# EAGLE design CAP-MODULE (EAGLE 9.6.2)
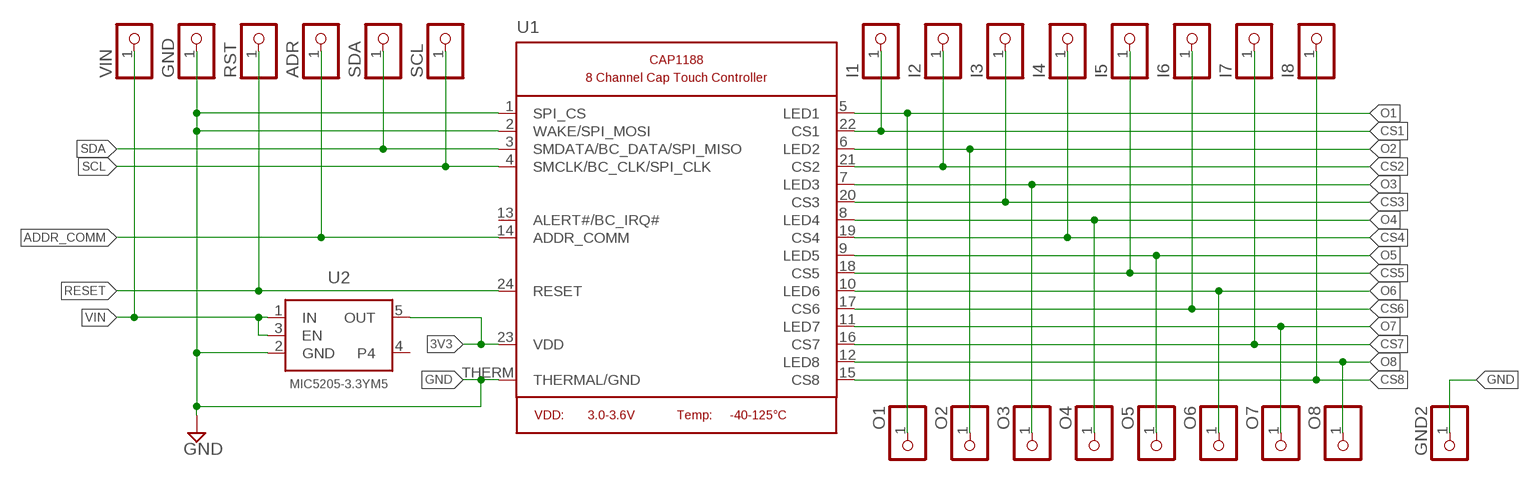
[diagram p0: schematic, sheet 1]

## Parts
ADR  PINHD-1X1CB  [1X01-CLEANBIG]
GND  PINHD-1X1CB  [1X01-CLEANBIG]
GND2  PINHD-1X1CB  [1X01-CLEANBIG]
I1  PINHD-1X1CB  [1X01-CLEANBIG]
I2  PINHD-1X1CB  [1X01-CLEANBIG]
I3  PINHD-1X1CB  [1X01-CLEANBIG]
I4  PINHD-1X1CB  [1X01-CLEANBIG]
I5  PINHD-1X1CB  [1X01-CLEANBIG]
I6  PINHD-1X1CB  [1X01-CLEANBIG]
I7  PINHD-1X1CB  [1X01-CLEANBIG]
I8  PINHD-1X1CB  [1X01-CLEANBIG]
O1  PINHD-1X1CB  [1X01-CLEANBIG]
O2  PINHD-1X1CB  [1X01-CLEANBIG]
O3  PINHD-1X1CB  [1X01-CLEANBIG]
O4  PINHD-1X1CB  [1X01-CLEANBIG]
O5  PINHD-1X1CB  [1X01-CLEANBIG]
O6  PINHD-1X1CB  [1X01-CLEANBIG]
O7  PINHD-1X1CB  [1X01-CLEANBIG]
O8  PINHD-1X1CB  [1X01-CLEANBIG]
RST  PINHD-1X1CB  [1X01-CLEANBIG]
SCL  PINHD-1X1CB  [1X01-CLEANBIG]
SDA  PINHD-1X1CB  [1X01-CLEANBIG]
U1  MICROBUILDER_CAP1188  [MICROBUILDER_QFN24_4MM_SMSC]
U2  MIC5205-3.3YM5  MICROBUILDER_VREG_SOT23-5  [MICROBUILDER_SOT23-5]
VIN  PINHD-1X1CB  [1X01-CLEANBIG]

## Nets
3V3 [8 mil]: U1.23(VDD) U2.5(OUT)
ADDR_COMM [8 mil]: ADR.1 U1.14(ADDR_COMM)
CS1 [8 mil]: I1.1 U1.22(CS1)
CS2 [8 mil]: I2.1 U1.21(CS2)
CS3 [8 mil]: I3.1 U1.20(CS3)
CS4 [8 mil]: I4.1 U1.19(CS4)
CS5 [8 mil]: I5.1 U1.18(CS5)
CS6 [8 mil]: I6.1 U1.17(CS6)
CS7 [8 mil]: I7.1 U1.16(CS7)
CS8 [8 mil]: I8.1 U1.15(CS8)
GND [8 mil]: GND2.1 GND.1 U1.1(SPI_CS) U1.2(WAKE/SPI_MOSI) U1.THERM(THERMAL/GND) U2.2(GND)
O1 [8 mil]: O1.1 U1.5(LED1)
O2 [8 mil]: O2.1 U1.6(LED2)
O3 [8 mil]: O3.1 U1.7(LED3)
O4 [8 mil]: O4.1 U1.8(LED4)
O5 [8 mil]: O5.1 U1.9(LED5)
O6 [8 mil]: O6.1 U1.10(LED6)
O7 [8 mil]: O7.1 U1.11(LED7)
O8 [8 mil]: O8.1 U1.12(LED8)
RESET [8 mil]: RST.1 U1.24(RESET)
SCL [8 mil]: SCL.1 U1.4(SMCLK/BC_CLK/SPI_CLK)
SDA [8 mil]: SDA.1 U1.3(SMDATA/BC_DATA/SPI_MISO)
VIN [8 mil]: U2.1(IN) U2.3(EN) VIN.1
Unconnected: U1.13(ALERT#/BC_IRQ#) U2.4

## Library data of the parts
ADR GND GND2 I1-I8 O1-O8 RST SCL SDA VIN = adafruit:PINHD-1X1: Pin header 1x1 for 0.1" spacing With round pins
U1 = Adafruit CAP1188:MICROBUILDER_CAP1188: CAP1188 - Eight Channel Cap Touch Controller
U2 = Adafruit CAP1188:MICROBUILDER_VREG_SOT23-5: SOT23-5 Fixed Voltage Regulators Part Current Out V Out V In V Dropout θJA (°C/W) TJ (°C) Digikey Part No. ADP121 150mA 3.3V 3.4-5.5V 0.09V @ 150mA -- -- ADP121-AUJZ33R7CT-ND ADP121 150mA 3.0V 3.1-5.5V 0.09V @ 150mA -- -- ADP121-AUJZ30R7CT-ND ADP122 300mA 3.3V 3.4-5.5V 0.085V @ 300mA -- -- ADP122AUJZ-3.3-R7CT-ND ADP1712 300mA 3.3V 3.5-5.5V 0.17V @ 300mA -- -- ADP1712AUJZ-3.3-R7TR-ND AP7311 (Low Cost) 150mA 3.3V 3.5-6V 0.15V @ 150mA -- -- AP7311-33WG-7DICT-ND LD39015M18R 150mA 1.8V 1.9V-5.5V 0.08V @ 100mA -- -- 497-6977-1-ND LP2985A-33DBVR 150mA 3.3V 3.3-16V 0.28V @ 150mA 206 150 296-18479-1-ND MCP1824T-3302E/OT 300mA 3.3V 3.5V-6V 0.2V @ 300mA -- -- MCP1824T-3302E/OTCT-ND MIC5205-2.5YM5 TR 150mA 2.5V 2.7-16V 0.165V @ 150mA -- -- 576-1257-2-ND MIC5205-3.0YM5 TR 150mA 3.0V 3.2V-16V 0.165V @ 150mA -- -- 576-1258-2-ND MIC5205-3.3YM5 TR 150mA 3.3V 3.5V-16V 0.165V @ 150mA -- -- 576-1259-2-ND TPS780330220 150mA 3.3V+2.2V 3.6-5.5V 250mV Max -- -- 296-23332-1-ND TDA3663/N1,135 100mA 3.3V 3.5-45V 0.18V @ 50mA -- -- 568-5343-1-ND Max operating temp can be calculated using θJA, TJ (max junction temperature), and power in watts. Set the "Maximum Ambient Temperature" until it reaches TJ ("Max Junction Temperature"), which is the absolute limit for safe use of the regulator: Heat Sink Temperature Calculator <http://www.daycounter.com/Calculators/Heat-Sink-Temperature-Calculator.phtml> For example, With 12V source into a 3.3V LP2985 and a 30mA load, we are dissipating (12V-3.3V) * 0.03A = 0.261W. With a θJA of 206 °C/W, a TJ of 150°C, and 261mW we can safely use the chip without a heat sink up to 75°C (=147.1°C Junction Temperature).

## Net classes
1 8 mil: width 0.203 mm

## Board
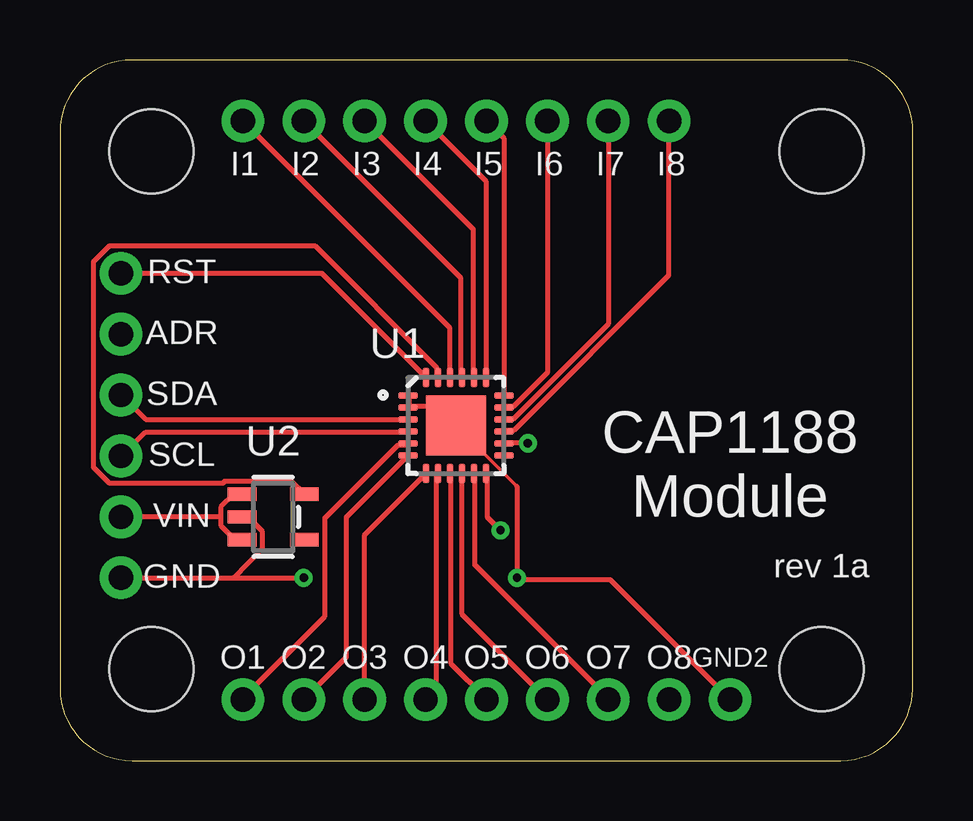
[diagram p1: board, top side]
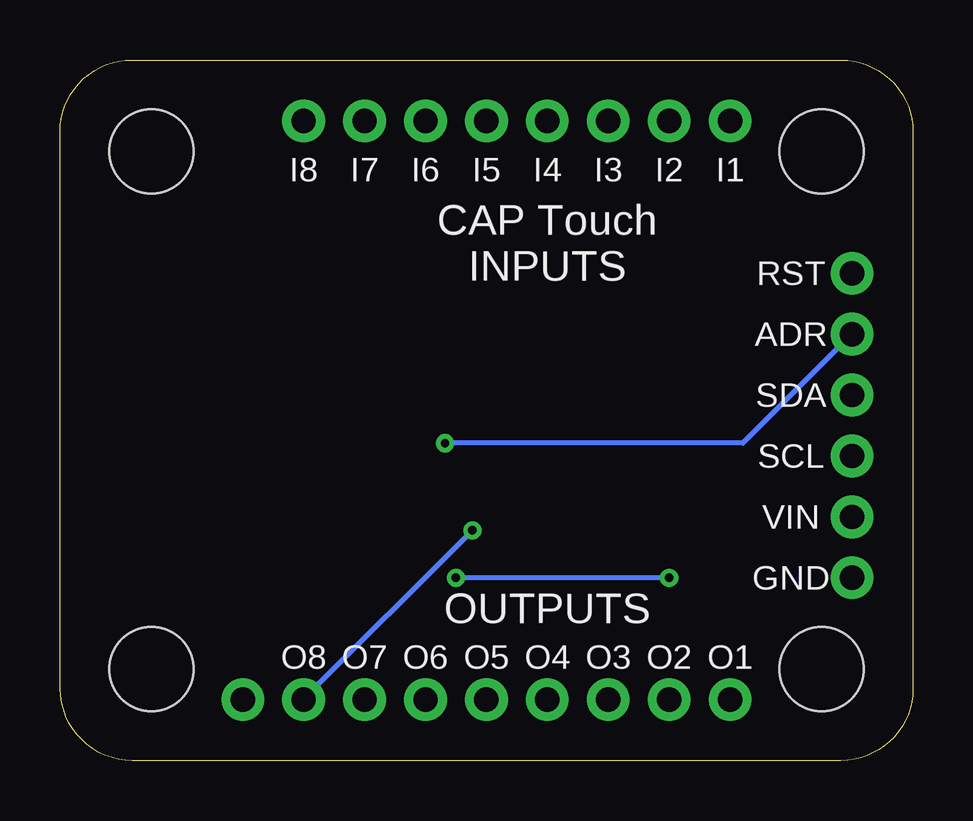
[diagram p2: board, bottom side, seen from below]

Size 35.56 x 29.21 mm. Coordinates in mm from the lower left corner, seen from the top.
Outline: 0,26.21 0,3 arc90 3,0 32.54,0 arc90 35.54,3 35.56,26.21 arc90 32.56,29.21 3,29.21 arc90 0,26.21
Copper layers (1*16): Top 0.035mm / dielectric 1.5mm / Bottom 0.035mm
Design rules "default": minimum track width 6mil, minimum drill 0.35mm, track to track 6mil, track to pad 6mil, pad to pad 6mil, via to via 6mil, smd to smd 6mil, copper to edge 40mil, drill to drill 6mil, minimum pad ring 10mil, minimum via ring 8mil, stop-mask expansion 4mil, vias tented up to drill 0mil, thermal gap 10mil
Holes 3.5 mm at 3.81,3.81 3.81,25.4 31.75,25.4 31.75,3.81

### Footprints (pad centres in the part's own frame; a part is rotated, then mirrored left to right if it is on the bottom)
1X01-CLEANBIG = drill 1.016 pad 1.778: 1 0,0
MICROBUILDER_QFN24_4MM_SMSC = smd 0.8 x 0.28: 1 -2,1.25; 2 -2,0.75; 3 -2,0.25; 4 -2,-0.25; 5 -2,-0.75; 6 -2,-1.25; 13 2,-1.25; 14 2,-0.75; 15 2,-0.25; 16 2,0.25; 17 2,0.75; 18 2,1.25 | smd 0.28 x 0.8: 7 -1.25,-2; 8 -0.75,-2; 9 -0.25,-2; 10 0.25,-2; 11 0.75,-2; 12 1.25,-2; 19 1.25,2; 20 0.75,2; 21 0.25,2; 22 -0.25,2; 23 -0.75,2; 24 -1.25,2 | smd 2.5 x 2.5: THERM 0,0
MICROBUILDER_SOT23-5 = smd 0.55 x 1.2: 1 -0.95,-1.3; 2 0,-1.3; 3 0.95,-1.3; 4 0.95,1.3; 5 -0.95,1.3

### Placement (x,y rotation side)
ADR  2.54,17.78 180 top
GND  2.54,7.62 180 top
GND2  27.94,2.54 0 top
I1  7.62,26.67 90 top
I2  10.16,26.67 90 top
I3  12.7,26.67 90 top
I4  15.24,26.67 90 top
I5  17.78,26.67 90 top
I6  20.32,26.67 90 top
I7  22.86,26.67 90 top
I8  25.4,26.67 90 top
O1  7.62,2.54 0 top
O2  10.16,2.54 0 top
O3  12.7,2.54 0 top
O4  15.24,2.54 0 top
O5  17.78,2.54 0 top
O6  20.32,2.54 0 top
O7  22.86,2.54 0 top
O8  25.4,2.54 0 top
RST  2.54,20.32 180 top
SCL  2.54,12.7 180 top
SDA  2.54,15.24 180 top
U1  16.51,13.97 0 top
U2  8.89,10.16 270 top
VIN  2.54,10.16 180 top

### Tracks (layer width: path | path; a pad name or v marks a point on that pad's centre or on a via)
3V3
  Top 0.203: U1.23 15.7,16.03 15.7,16.39 10.62,21.46 2.07,21.46 1.4,20.79 1.4,12.23 2.07,11.56 6.78,11.56 6.86,11.64 9.66,11.64 U2.5
ADDR_COMM  (via drill 0.35)
  Top 0.203: v19.51,13.23 18.52,13.23 U1.14
  Bottom 0.203: v19.51,13.23 7.09,13.23 ADR.1
CS1
  Top 0.203: I1.1 16.23,18.06 16.23,16 U1.22
CS2
  Top 0.203: U1.21 16.69,16.04 16.69,20.14 I2.1
CS3
  Top 0.203: U1.20 17.22,16.01 17.22,22.15 I3.1
CS4
  Top 0.203: I4.1 17.75,24.16 U1.19
CS5
  Top 0.203: I5.1 18.51,25.94 U1.18
CS6
  Top 0.203: U1.17 18.55,14.76 18.91,14.76 20.32,16.17 I6.1
CS7
  Top 0.203: U1.16 18.88,14.22 22.86,18.21 I7.1
CS8
  Top 0.203: U1.15 18.56,13.77 18.92,13.77 25.38,20.22 25.38,26.64 I8.1
GND  (via drill 0.35)
  Top 0.152: 19.05,11.43 U1.THERM
  Top 0.203: U2.2 7.64,10.11 7.89,10.11 8.42,9.58 8.42,8.84 7.24,7.62 | GND.1 7.24,7.62 | 7.24,7.62 v10.16,7.62 | 19.05,11.43 v19.05,7.62 19.13,7.54 22.94,7.54 GND2.1 | U1.1 14.55,15.21 14.55,14.76 U1.2 14.63,14.76 15.7,14.76 16.46,13.99 U1.THERM
  Bottom 0.203: v10.16,7.62 v19.05,7.62
O1
  Top 0.203: O1.1 7.62,2.59 11.05,6.02 11.05,10.12 14.09,13.16 14.45,13.16 U1.5
O2
  Top 0.203: O2.1 11.94,4.32 11.94,10.15 U1.6
O3
  Top 0.203: O3.1 12.7,9.41 U1.7
O4
  Top 0.203: O4.1 15.24,2.59 15.7,3.05 15.7,11.91 U1.8
O5
  Top 0.203: O5.1 17.78,2.56 16.31,4.04 16.31,11.92 U1.9
O6
  Top 0.203: O6.1 16.76,6.1 U1.10
O7
  Top 0.203: O7.1 22.86,2.59 17.3,8.15 17.3,11.93 U1.11
O8  (via drill 0.35)
  Top 0.203: v18.36,9.6 17.83,10.13 17.83,11.96 U1.12
  Bottom 0.203: O8.1 25.4,2.56 v18.36,9.6
RESET
  Top 0.203: RST.1 10.91,20.32 U1.24
SCL
  Top 0.203: SCL.1 2.59,12.7 3.58,13.69 14.48,13.69 U1.4
SDA
  Top 0.203: SDA.1 2.56,15.24 3.58,14.22 U1.3
VIN
  Top 0.203: 6.71,10.19 6.71,10.57 7.24,11.1 7.54,11.1 U2.1 | 6.71,10.19 6.71,9.8 7.24,9.27 7.54,9.27 U2.3 | 6.71,10.19 2.59,10.19 VIN.1

### Text on the board
tPlace: CAP1188 / Module | rev 1a
bPlace: I1 | I2 | I3 | I4 | I5 | I6 | I7 | I8 | CAP Touch / INPUTS | RST | ADR | SDA | SCL | VIN | GND | OUTPUTS | O1 | O2 | O3 | O4 | O5 | O6 | O7 | O8